# Altium schematic sheet Top.SchDoc
size B; Author: E. Sims; Organization: Let's Build Rockets Inc.
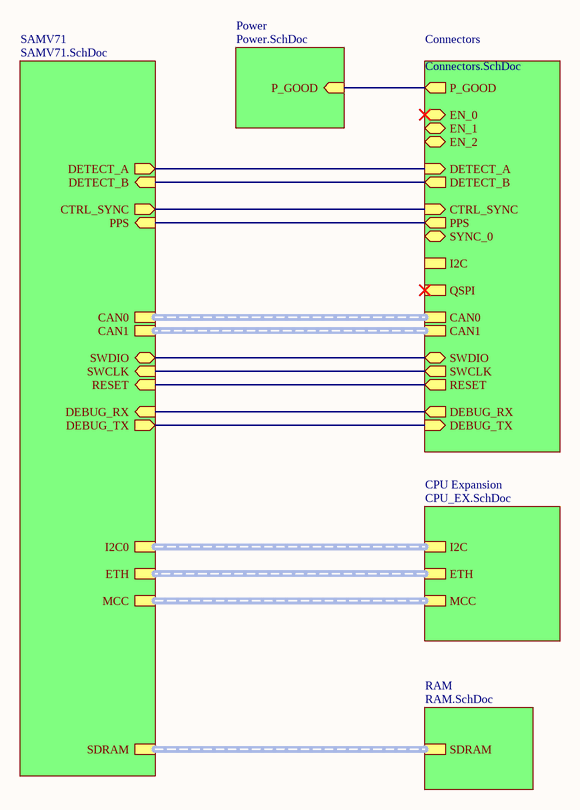
[diagram p0: Top.SchDoc]

## Sub-sheets
Connectors = Connectors.SchDoc: CAN0 (harness CAN), CAN1 (harness CAN), SYNC_0 (bidir), EN_2 (bidir), DETECT_A (in), SWDIO (bidir), CTRL_SYNC (in), P_GOOD (out), EN_1 (bidir), EN_0 (bidir), DETECT_B (out), DEBUG_RX (out), PPS (out), QSPI (harness QSPI), RESET (out), DEBUG_TX (in), SWCLK (out), I2C (harness I2C)
CPU Expansion = CPU_EX.SchDoc: ETH (harness ETH), MCC (harness MCC), I2C (harness I2C)
Power = Power.SchDoc: P_GOOD (in)
RAM = RAM.SchDoc: SDRAM (harness SDRAM)
SAMV71 = SAMV71.SchDoc: SDRAM (harness SDRAM), CAN0 (harness CAN), I2C0 (harness I2C), MCC (harness MCC), CAN1 (harness CAN), ETH (harness ETH), DETECT_A (out), PPS (in), DETECT_B (in), CTRL_SYNC (out), DEBUG_RX (in), SWDIO (bidir), SWCLK (in), DEBUG_TX (out), RESET (in)

## Nets
(unnamed): sheet SAMV71/DETECT_A, sheet Connectors/DETECT_A
(unnamed): sheet SAMV71/PPS, sheet Connectors/PPS
(unnamed): sheet SAMV71/DETECT_B, sheet Connectors/DETECT_B
(unnamed): sheet SAMV71/CTRL_SYNC, sheet Connectors/CTRL_SYNC
(unnamed): sheet SAMV71/DEBUG_RX, sheet Connectors/DEBUG_RX
(unnamed): sheet SAMV71/SWDIO, sheet Connectors/SWDIO
(unnamed): sheet SAMV71/SWCLK, sheet Connectors/SWCLK
(unnamed): sheet SAMV71/DEBUG_TX, sheet Connectors/DEBUG_TX
(unnamed): sheet SAMV71/RESET, sheet Connectors/RESET
(unnamed): sheet Connectors/P_GOOD, sheet Power/P_GOOD

## Buses and harness runs
harness sheet Connectors/CAN0 = sheet SAMV71/CAN0
harness sheet Connectors/CAN1 = sheet SAMV71/CAN1
harness sheet CPU Expansion/ETH = sheet SAMV71/ETH
harness sheet CPU Expansion/I2C = sheet SAMV71/I2C0
harness sheet CPU Expansion/MCC = sheet SAMV71/MCC
harness sheet RAM/SDRAM = sheet SAMV71/SDRAM

## Notes on the sheet
- Let's Build Rocket's Inc. Modular Paylaod System Based on TMP-010 Rev
  For more information visit https://github.com/LetsBuildRockets/Modular-Payload-System
  This work is licensed under CC BY-NC 4.0. To view a copy of this license, visit https://creativecommons.org/licenses/by-nc/4.0
- Title
- Size:
- Date:
- Assembly Variant:
- B
- Number:
- Time:
- Revision:
- Sheet
- of
- Author:
- File: